# EAGLE schematic BatMonLED (EAGLE 6.4)
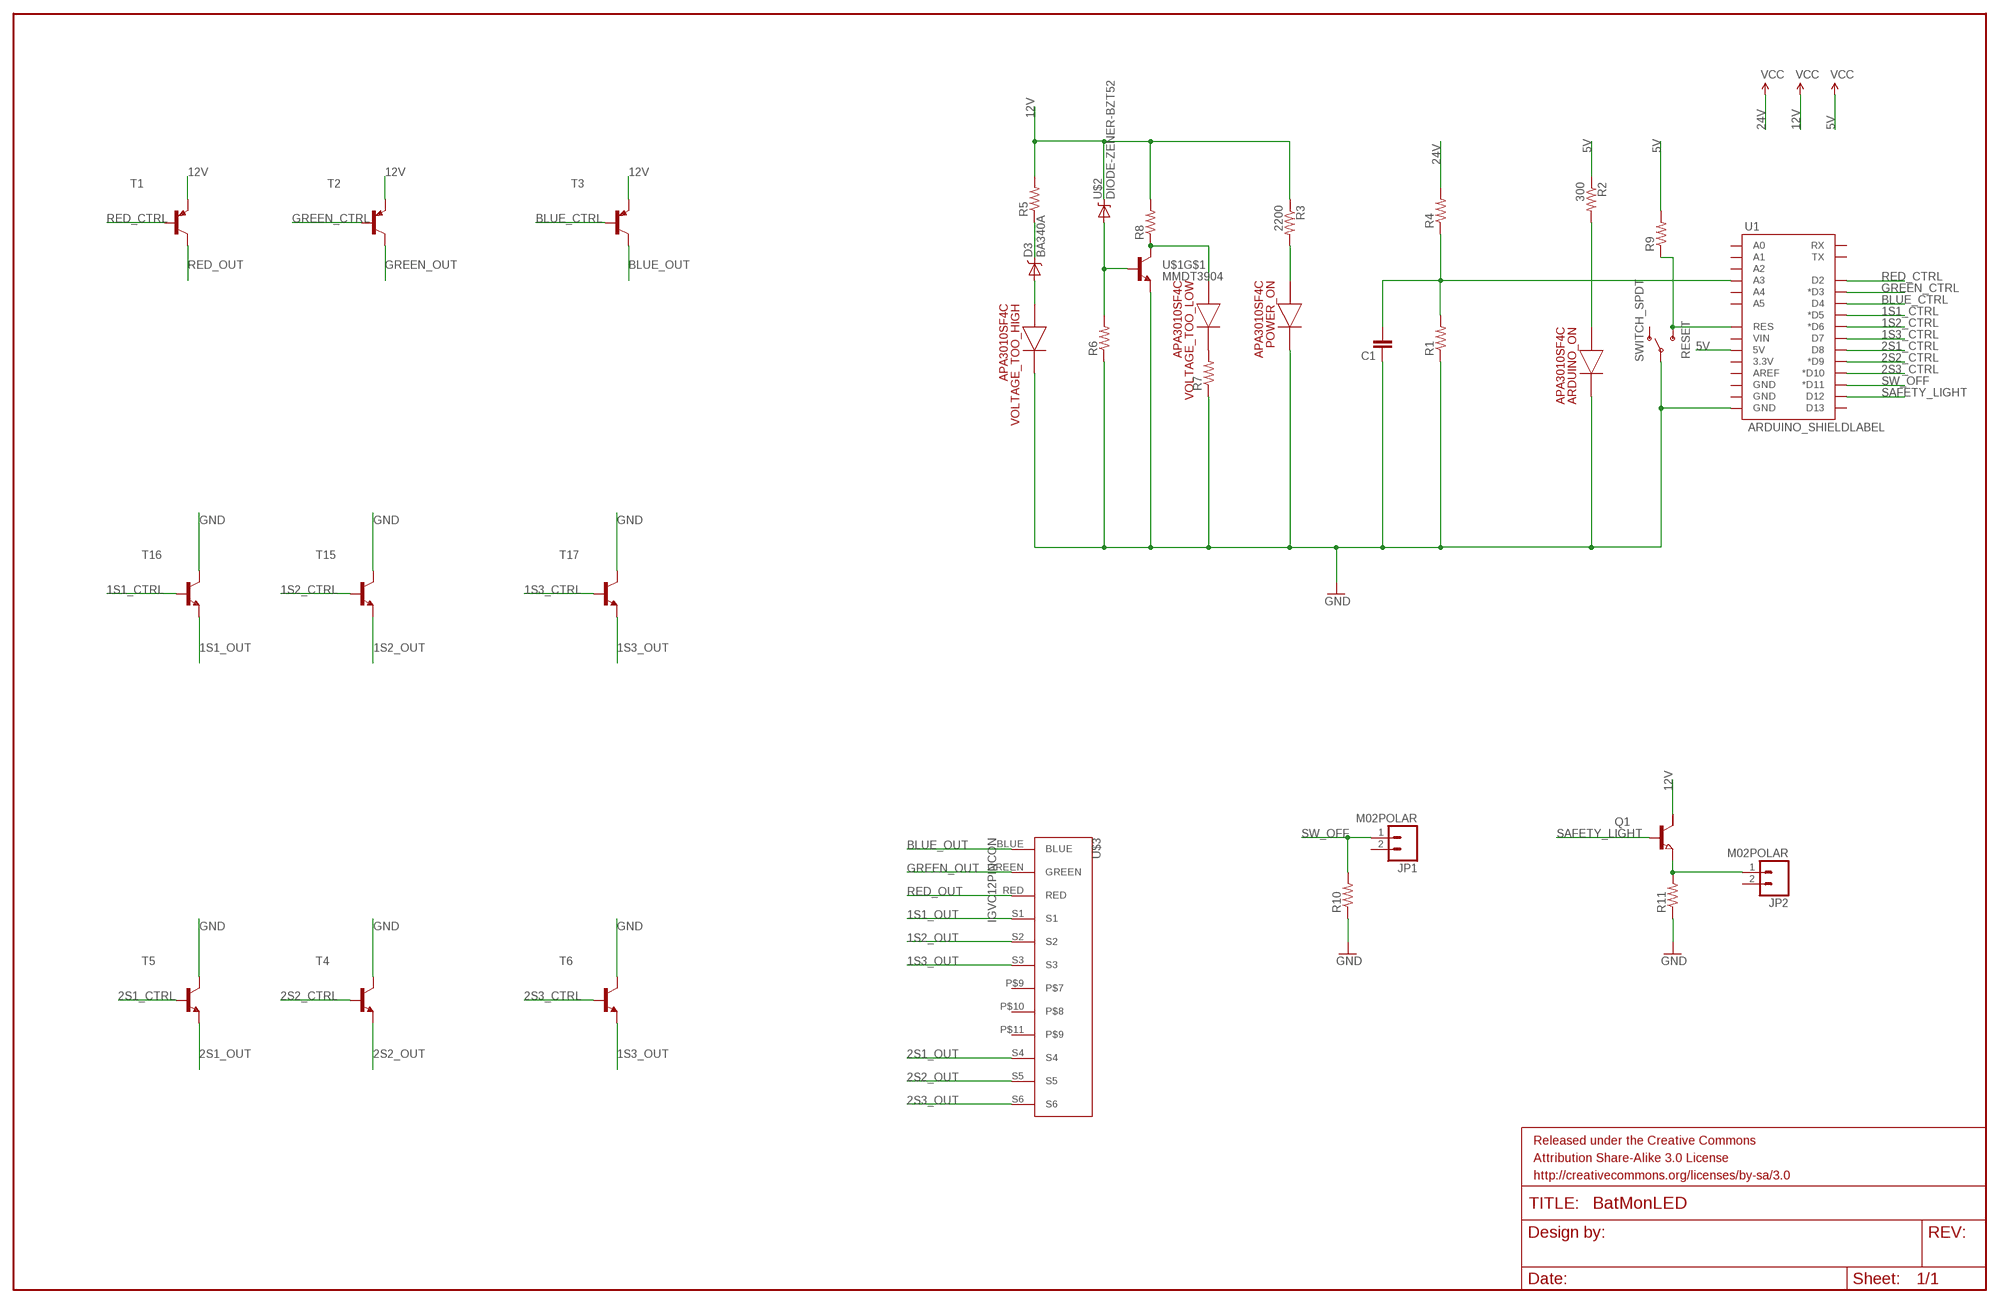
[diagram p0: schematic, sheet 1]

## Parts
ARDUINO_ON  APA3010SF4C  [APA3010SF4C]
C1  CAP0402-CAP  [0402-CAP]
D3  BA340A  B340A  [SMA-DIODE]
FRAME1  FRAME-LEDGER  [CREATIVE_COMMONS]
JP1  M02POLAR  [MOLEX-1X2]
JP2  M02POLAR  [MOLEX-1X2]
POWER_ON  APA3010SF4C  [APA3010SF4C]
Q1  NPN-TRANSISTIOR-2COLSOT143  [SOT143]
R1  RESISTOR0402-RES  [0402-RES]
R2  300  RESISTOR0603  [0603-RES]
R3  2200  RESISTOR0603  [0603-RES]
R4  RESISTOR0603  [0603-RES]
R5  RESISTOR0603  [0603-RES]
R6  RESISTOR0603  [0603-RES]
R7  RESISTOR0603-RES  [0603-RES]
R8  RESISTOR0603-RES  [0603-RES]
R9  RESISTOR0603  [0603-RES]
R10  RESISTOR0603  [0603-RES]
R11  RESISTOR0603  [0603-RES]
RESET  SWITCH_SPDT  [KPS-1290]
T1  -PNP-TO220V  [TO220V]
T2  -PNP-TO220V  [TO220V]
T3  -PNP-TO220V  [TO220V]
T4  -NPN-TO220V  [TO220V]
T5  -NPN-TO220V  [TO220V]
T6  -NPN-TO220  [TO220]
T15  -NPN-TO220V  [TO220V]
T16  -NPN-TO220V  [TO220V]
T17  -NPN-TO220  [TO220]
U1  ARDUINO_SHIELDLABEL  [DUEMILANOVE_SHIELD]
U$1  MMDT3904  [SOT363]
U$2  DIODE-ZENER-BZT52  [SOD-323]
U$3  IGVC12PINCON  [IGVC12PINPKG]
VOLTAGE_TOO_HIGH  APA3010SF4C  [APA3010SF4C]
VOLTAGE_TOO_LOW  APA3010SF4C  [APA3010SF4C]

## Nets
1S1_CTRL: T16.1(B) U1.D5(*D5)
1S1_OUT: T16.3(E) U$3.S1
1S2_CTRL: T15.1(B) U1.D6(*D6)
1S2_OUT: T15.3(E) U$3.S2
1S3_CTRL: T17.1(B) U1.D7
1S3_OUT: T6.3(E) T17.3(E) U$3.S3
2S1_CTRL: T5.1(B) U1.D8
2S1_OUT: T5.3(E) U$3.S4
2S2_CTRL: T4.1(B) U1.D9(*D9)
2S2_OUT: T4.3(E) U$3.S5
2S3_CTRL: T6.1(B) U1.D10(*D10)
2S3_OUT: U$3.S6
5V: R2.1 R9.2 U1.5V ; supply symbol labelled VCC
12V: Q1.2(C) R3.1 R5.2 R8.2 T1.3(E) T2.3(E) T3.3(E) U$2.1(C) ; supply symbol labelled VCC
24V: R4.2 ; supply symbol labelled VCC
BLUE_CTRL: T3.1(B) U1.D4
BLUE_OUT: T3.2(C) U$3.BLUE
GND: ARDUINO_ON.2 C1.1 POWER_ON.2 R1.1 R6.1 R7.1 R10.1 R11.1 RESET.P T4.2(C) T5.2(C) T6.2(C) T15.2(C) T16.2(C) T17.2(C) U1.GND@0(GND) U$1.4(E) VOLTAGE_TOO_HIGH.2
GREEN_CTRL: T2.1(B) U1.D3(*D3)
GREEN_OUT: T2.2(C) U$3.GREEN
N$1: C1.2 R1.2 R4.1 U1.A3
N$2: POWER_ON.1 R3.2
N$3: R8.1 U$1.3(C) VOLTAGE_TOO_LOW.1
N$4: R6.2 U$1.5(B) U$2.2(A)
N$5: ARDUINO_ON.1 R2.2
N$6: JP2.1 Q1.3(E) R11.2
N$7: D3.C R5.1
N$8: D3.A VOLTAGE_TOO_HIGH.1
N$10: R7.2 VOLTAGE_TOO_LOW.2
N$12: R9.1 RESET.S U1.RES
RED_CTRL: T1.1(B) U1.D2
RED_OUT: T1.2(C) U$3.RED
SAFETY_LIGHT: Q1.1(B) U1.D12
SW_OFF: JP1.1 R10.2 U1.D11(*D11)
Unconnected: JP1.2 JP2.2 Q1.4(C/) RESET.O U1.3.3V U1.A0 U1.A1 U1.A2 U1.A4 U1.A5 U1.AREF U1.D13 U1.GND@1(GND) U1.GND@2(GND) U1.RX U1.TX U1.VIN U$1.1(E) U$1.2(B) U$1.6(C) U$3.P$9 U$3.P$10 U$3.P$11

## Library data of the parts
ARDUINO_ON POWER_ON VOLTAGE_TOO_HIGH VOLTAGE_TOO_LOW = SparkFun-LED:APA3010SF4C: Right-angle 880nm SMT infrared LED
C1 = SparkFun-Capacitors:CAP: Capacitor Standard 0603 ceramic capacitor, and 0.1" leaded capacitor.
D3 = SparkFun-DiscreteSemi:B340A: Schottky Diode 3A-40V; PROD_ID: DIO-09886
FRAME1 = SparkFun-Aesthetics:FRAME-LEDGER: Schematic Frame Standard 11x14 US Ledger frame
JP1 JP2 = SparkFun-Connectors:M02: Standard 2-pin 0.1" header. Use with - straight break away headers ( PRT-00116) - right angle break away headers (PRT-00553) - swiss pins (PRT-00743) - machine pins (PRT-00117) - female headers (PRT-00115) Molex polarized connector foot print use with: PRT-08233 with associated crimp pins and housings. 2.54_SCREWTERM for use with PRT-10571. 3.5mm Screw Terminal footprints for PRT-08084 5mm Screw Terminal footprints for use with PRT-08433
Q1 = semicon-smd-ipc:NPN-TRANSISTIOR-2COL: NPN TRANSISTOR 2 colletor pins
R1 = SparkFun-Passives:RESISTOR: Resistor Basic schematic elements and footprints for 0603, 1206, and PTH resistors.
R2-R11 = SparkFun-Resistors:RESISTOR: Resistor Basic schematic elements and footprints for 0603, 1206, and PTH resistors.
RESET = SparkFun-Electromechanical:SWITCH_SPDT: Side-actuated SPDT slide switch, as used on the Arduino Pro
T1-T3 = transistor:*-PNP-: PNP Transistror
T4-T6 T15-T17 = transistor:*-NPN-: NPN Transistror BF959 corrected 2008.03.06
U1 = SparkFun-Boards:ARDUINO_SHIELD: Arduino shield footprint
U$1 = SparkFun-DiscreteSemi:MMDT3904: Dual NPN transistor
U$2 = SparkFun-DiscreteSemi:DIODE-ZENER: Zener Diode Production Part - 8199 3.4V Zener Voltage
U$3 = IGVC12PinCon:IGVC12PINCON